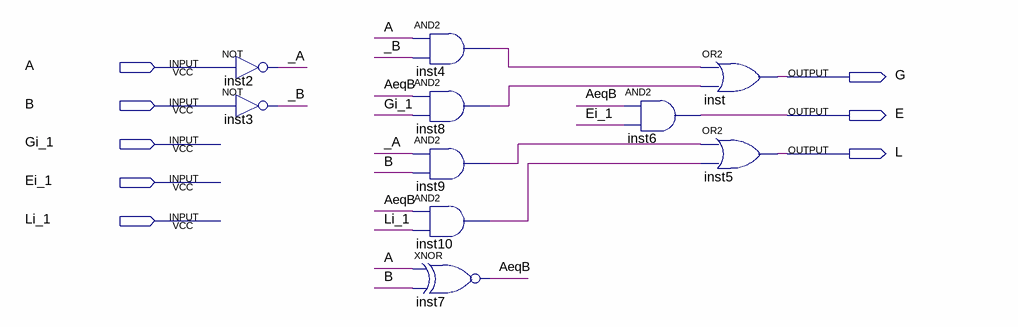
[diagram p0: schematic sheet]
// Quartus schematic CMP1.bdf as structural Verilog: 10 symbols, 8 pins
module CMP1 (
  input  A,
  input  B,
  input  Gi_1,
  input  Ei_1,
  input  Li_1,
  output G,
  output E,
  output L
);

  wire _A, _B, AeqB, inst4_out, inst8_out, inst9_out, inst10_out;

  not inst2 (_A, A);
  not inst3 (_B, B);
  and inst4 (inst4_out, A, _B);
  and inst8 (inst8_out, AeqB, Gi_1);
  and inst9 (inst9_out, _A, B);
  and inst10 (inst10_out, AeqB, Li_1);
  xnor inst7 (AeqB, A, B);
  and inst6 (E, AeqB, Ei_1);
  or inst (G, inst4_out, inst8_out);
  or inst5 (L, inst9_out, inst10_out);
endmodule
